# Altium schematic sheet PWR-ORing IC 2V to 5V.SchDoc
size Letter
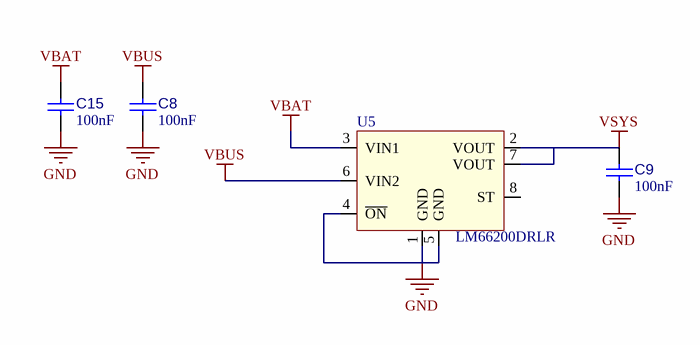
[diagram p0: PWR-ORing IC 2V to 5V.SchDoc]

## Parts
C8  value 100nF  [C_1005[0402]]  (hidden comment: Cap 100nF 0402)
C9  value 100nF  [C_1005[0402]]  (hidden comment: Cap 100nF 0402)
C15  value 100nF  [C_1005[0402]]  (hidden comment: Cap 100nF 0402)
U5  LM66200DRLR  [U_SOT583_50P210X120X60-8]

## Nets
GND: C8.1 C9.1 C15.1 U5.1(GND) U5.4(~{ON}) U5.5(GND)
VBAT: C15.2 U5.3(VIN1)
VBUS: C8.2 U5.6(VIN2)
VSYS: C9.2 U5.2(VOUT) U5.7(VOUT)

Not connected (* = marked no-connect by the designer): U5 8(ST)

## Library data of the parts
C8 C9 C15 = CAP001: Capacitor type 1; Manufacturer 1: Taiyo Yuden; Manufacturer Part Number 1: UMK105B7104KV-FR; LibRef: CAP001; CEGEP: KCOND01SM; Tolerance: 10%; Rated Voltage: 50V; Dielectric: X7R; Supplier 1: LCSC; Supplier Part Number 1: C2167491; Mounting Technology: SMT
U5 = U_LM66200DRLR: ORing Controller N-Channel 2:1 SOT-583; Manufacturer 1: Texas Instruments; Manufacturer Part Number 1: LM66200DRLR; Supplier 1: LCSC; Supplier 2: Digikey; Supplier Part Number 1: C3235556; Supplier Part Number 2: 296-LM66200DRLRCT-ND; Mounting Technology: SMT